# EAGLE design hw3 (EAGLE 7.5.0)
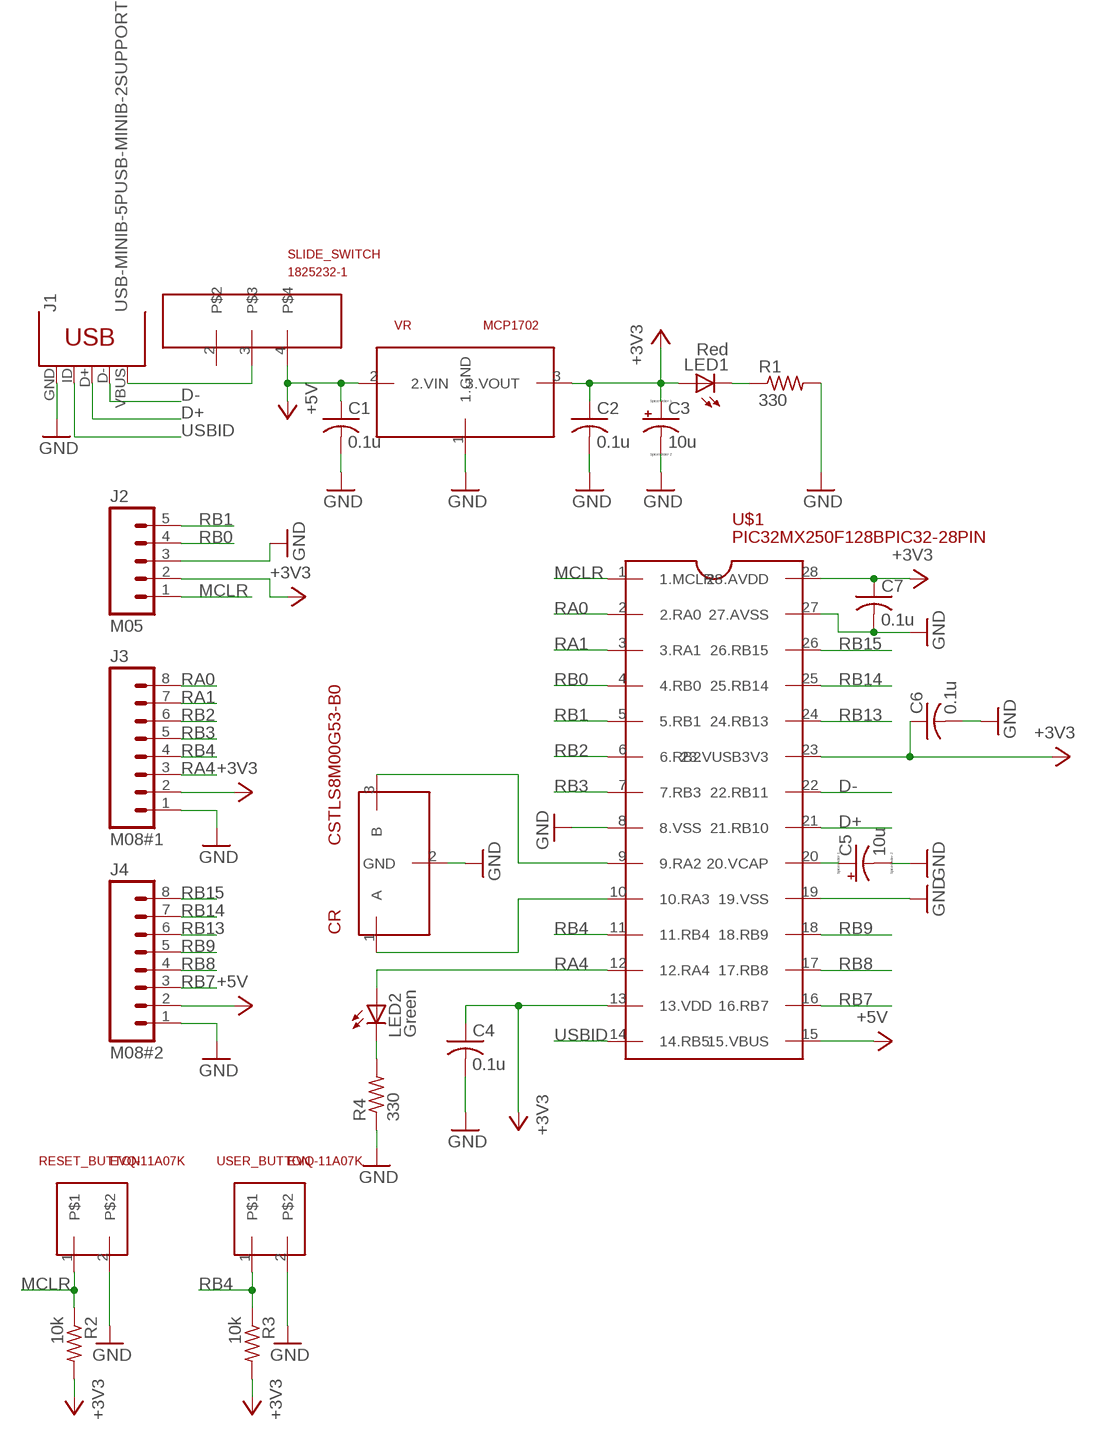
[diagram p0: schematic, sheet 1]

## Parts
C1  0.1u  C-US025-025X050  [C025-025X050]
C2  0.1u  C-US025-025X050  [C025-025X050]
C3  10u  CPOL-USB45181A  [B45181A]
C4  0.1u  C-US025-025X050  [C025-025X050]
C5  10u  CPOL-USB45181A  [B45181A]
C6  0.1u  C-US025-025X050  [C025-025X050]
C7  0.1u  C-US025-025X050  [C025-025X050]
CR  CSTLS8M00G53-B0  [1X03_NO_SILK]
J1  USB-MINIB-5PUSB-MINIB-2SUPPORT  [USB-MB-H]
J2  M05  M05NO_SILK  [1X05_NO_SILK]
J3  M08#1  M08  [1X08_ROUND]
J4  M08#2  M08  [1X08_ROUND]
LED1  Red  LED3MM  [LED3MM]
LED2  Green  LED3MM  [LED3MM]
R1  330  R-US_0207/10  [0207/10]
R2  10k  R-US_0207/10  [0207/10]
R3  10k  R-US_0207/10  [0207/10]
R4  330  R-US_0207/10  [0207/10]
RESET_BUTTON  EVQ-11A07K  [1X02_NO_SILK_FAR_BOUNDED]
SLIDE_SWITCH  1825232-1  [1X05_SLIDESWITCH]
U$1  PIC32MX250F128BPIC32-28PIN  [DIL28-3]
USER_BUTTON  EVQ-11A07K  [1X02_NO_SILK_FAR_BOUNDED]
VR  MCP1702  [TO92]

## Nets
+3V3: C2.1 C3.+ C4.1 C6.1 C7.1 J2.2 J3.2 LED1.A R2.2 R3.2 U$1.13(13.VDD) U$1.23(23.VUSB3V3) U$1.28(28.AVDD) VR.3(3.VOUT)
+5V: C1.1 J4.2 SLIDE_SWITCH.4 U$1.15(15.VBUS) VR.2(2.VIN)
D+: J1.D+ U$1.21(21.RB10)
D-: J1.D- U$1.22(22.RB11)
GND: C1.2 C2.2 C3.- C4.2 C5.- C6.2 C7.2 CR.2(GND) J1.GND J2.3 J3.1 J4.1 R1.2 R4.1 RESET_BUTTON.2 U$1.8(8.VSS) U$1.19(19.VSS) U$1.27(27.AVSS) USER_BUTTON.2 VR.1(1.GND)
MCLR: J2.1 R2.1 RESET_BUTTON.1 U$1.1(1.MCLR)
N$1: LED2.K(C) R4.2
N$2: C5.+ U$1.20(20.VCAP)
N$3: LED1.K(C) R1.1
N$4: J1.VBUS SLIDE_SWITCH.3
N$5: CR.3(B) U$1.9(9.RA2)
N$6: CR.1(A) U$1.10(10.RA3)
RA0: J3.8 U$1.2(2.RA0)
RA1: J3.7 U$1.3(3.RA1)
RA4: J3.3 LED2.A U$1.12(12.RA4)
RB0: J2.4 U$1.4(4.RB0)
RB1: J2.5 U$1.5(5.RB1)
RB2: J3.6 U$1.6(6.RB2)
RB3: J3.5 U$1.7(7.RB3)
RB4: J3.4 R3.1 U$1.11(11.RB4) USER_BUTTON.1
RB7: J4.3 U$1.16(16.RB7)
RB8: J4.4 U$1.17(17.RB8)
RB9: J4.5 U$1.18(18.RB9)
RB13: J4.6 U$1.24(24.RB13)
RB14: J4.7 U$1.25(25.RB14)
RB15: J4.8 U$1.26(26.RB15)
USBID: J1.ID U$1.14(14.RB5)
Unconnected: SLIDE_SWITCH.2

## Library data of the parts
C1 C2 C4 C6 C7 = hw2:C-US: CAPACITOR, American symbol
C3 C5 = hw2:CPOL-US: POLARIZED CAPACITOR, American symbol
CR = hw2:CSTLS8M00G53-B0: Crystal resonator. Middle pin is ground.
J1 = hw2:USB-MINIB-5P: Mini-USB "B" connector with 5th pin broken out. Created new symbol breaking out 5th "ID" pin in mini/micro USB connector spec. See: http://en.wikipedia.org/wiki/Mini_usb#Cables. Uses same footprint as 4-pin symbol. Also added pins to connect to mounting / shield pads if required (probably not generally needed as signals aren't shielded once they leave the connector).
J2 = hw2:M05: Header 5 Standard 5-pin 0.1" header. Use with straight break away headers (SKU : PRT-00116), right angle break away headers (PRT-00553), swiss pins (PRT-00743), machine pins (PRT-00117), and female headers (PRT-00115). Molex polarized connector foot print use with SKU : PRT-08230 with associated crimp pins and housings.
J3 J4 = hw2:M08: Header 8 Standard 8-pin 0.1" header. Use with straight break away headers (SKU : PRT-00116), right angle break away headers (PRT-00553), swiss pins (PRT-00743), machine pins (PRT-00117), and female headers (PRT-00115).; PROD_ID: CONN-08437
LED1 LED2 = hw2:LED: LED OSRAM: - CHIPLED LG R971, LG N971, LY N971, LG Q971, LY Q971, LO R971, LY R971 LH N974, LH R974 LS Q976, LO Q976, LY Q976 LO Q996 - Hyper CHIPLED LW Q18S LB Q993, LB Q99A, LB R99A - SideLED LS A670, LO A670, LY A670, LG A670, LP A670 LB A673, LV A673, LT A673, LW A673 LH A674 LY A675 LS A676, LA A676, LO A676, LY A676, LW A676 LS A679, LY A679, LG A679 - Hyper Micro SIDELED® LS Y876, LA Y876, LO Y876, LY Y876 LT Y87S - SmartLED LW L88C, LW L88S LB L89C, LB L89S, LG L890 LS L89K, LO L89K, LY L89K LS L896, LA L896, LO L896, LY L896 - TOPLED LS T670, LO T670, LY T670, LG T670, LP T670 LSG T670, LSP T670, LSY T670, LOP T670, LYG T670 LG T671, LOG T671, LSG T671 LB T673, LV T673, LT T673, LW T673 LH T674 LS T676, LA T676, LO T676, LY T676, LB T676, LH T676, LSB T676, LW T676 LB T67C, LV T67C, LT T67C, LS T67K, LO T67K, LY T67K, LW E67C LS E67B, LA E67B, LO E67B, LY E67B, LB E67C, LV E67C, LT E67C LW T67C LS T679, LY T679, LG T679 LS T770, LO T770, LY T770, LG T770, LP T770 LB T773, LV T773, LT T773, LW T773 LH T774 LS E675, LA E675, LY E675, LS T675 LS T776, LA T776, LO T776, LY T776, LB T776 LHGB T686 LT T68C, LB T68C - Hyper Mini TOPLED® LB M676 - Mini TOPLED Santana® LG M470 LS M47K, LO M47K, LY M47K Source: http://www.osram.convergy.de LUXEON: - LUMILED® LXK2-PW12-R00, LXK2-PW12-S00, LXK2-PW14-U00, LXK2-PW14-V00 LXK2-PM12-R00, LXK2-PM12-S00, LXK2-PM14-U00 LXK2-PE12-Q00, LXK2-PE12-R00, LXK2-PE12-S00, LXK2-PE14-T00, LXK2-PE14-U00 LXK2-PB12-K00, LXK2-PB12-L00, LXK2-PB12-M00, LXK2-PB14-N00, LXK2-PB14-P00, LXK2-PB14-Q00 LXK2-PR12-L00, LXK2-PR12-M00, LXK2-PR14-Q00, LXK2-PR14-R00 LXK2-PD12-Q00, LXK2-PD12-R00, LXK2-PD12-S00 LXK2-PH12-R00, LXK2-PH12-S00 LXK2-PL12-P00, LXK2-PL12-Q00, LXK2-PL12-R00 Source: www.luxeon.com KINGBRIGHT: KA-3528ASYC Source: www.kingbright.com
R1-R4 = hw2:R-US_: RESISTOR, American symbol
RESET_BUTTON USER_BUTTON = hw2:EVQ-11A07K: Pushbutton
SLIDE_SWITCH = hw2:1825232-1: Slide switch. Only PIN3 and PIN4 are used.
U$1 = hw2:PIC32MX250F128B
VR = hw2:MCP1702: Voltage regulator 1. GND 2. VIN 3. VOUT

## Board
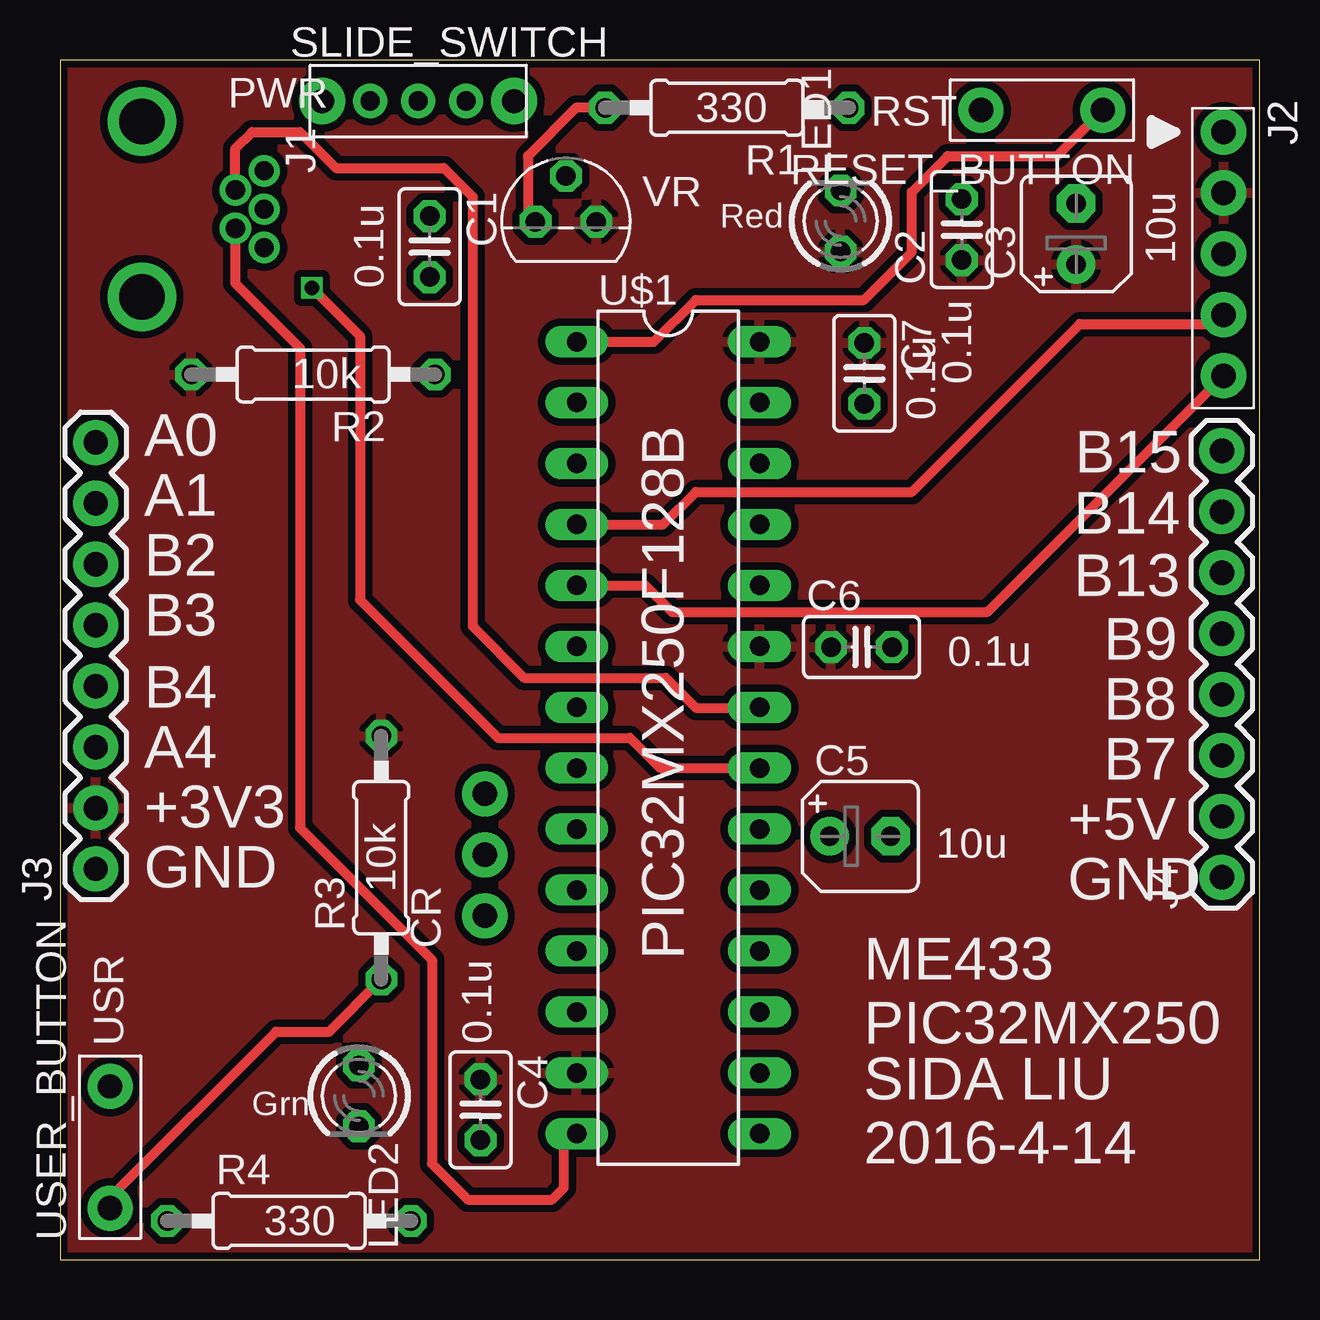
[diagram p1: board, top side]
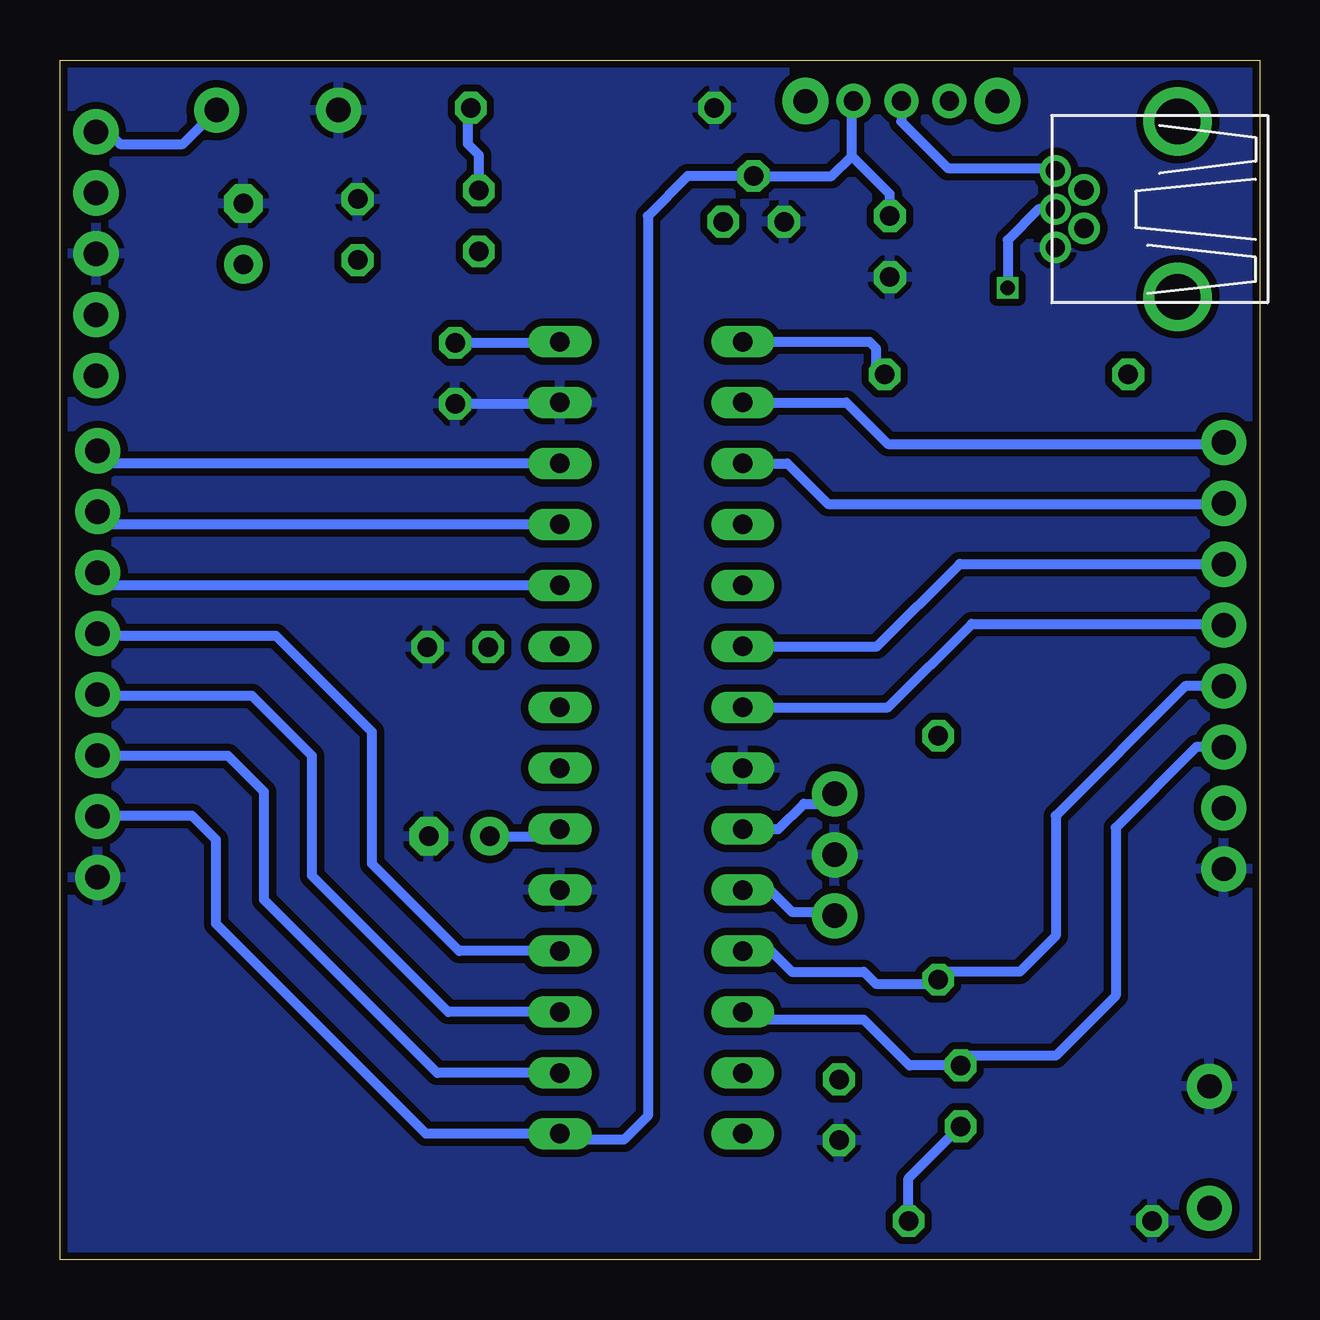
[diagram p2: board, bottom side, seen from below]

Size 50 x 50 mm. Coordinates in mm from the lower left corner, seen from the top.
Outline: 0,0 50,0 50,50 0,50 0,0
Copper layers (1*16): Top 0.035mm / dielectric 1.5mm / Bottom 0.035mm
Design rules "SeeedStudio_2layer_DRU_no_angle_20140221": minimum track width 6mil, minimum drill 12mil, track to track 6mil, track to pad 6mil, pad to pad 6mil, via to via 6mil, smd to smd 0mil, copper to edge 10mil, drill to drill 10mil, minimum pad ring 10mil, minimum via ring 6mil, stop-mask expansion 2mil, vias tented up to drill 100mil, thermal gap 10mil

### Footprints (pad centres in the part's own frame; a part is rotated, then mirrored left to right if it is on the bottom)
C025-025X050 = drill 0.813 octagon: 1 -1.27,0; 2 1.27,0
B45181A = drill 0.813 pad 1.6: + -1.27,0 | drill 0.813 pad 1.6 octagon: - 1.27,0
1X03_NO_SILK = drill 1.016 pad 1.88: 1 0,0; 2 2.54,0; 3 5.08,0
USB-MB-H = drill 0.8: D+ 5.1,0; D- 3.9,0.8; GND 5.1,-1.6; ID 3.9,-0.8; VBUS 5.1,1.6 | drill 1.9: P$6 0,-3.65; P$7 0,3.65
1X05_NO_SILK = drill 1.016 pad 1.88: 1 0,0; 2 2.54,0; 3 5.08,0; 4 7.62,0; 5 10.16,0
1X08_ROUND = drill 1.016 pad 1.88: 1 0,0; 2 2.54,0; 3 5.08,0; 4 7.62,0; 5 10.16,0; 6 12.7,0; 7 15.24,0; 8 17.78,0
LED3MM = drill 0.813 octagon: A -1.27,0; K 1.27,0
0207/10 = drill 0.813 octagon: 1 -5.08,0; 2 5.08,0
1X02_NO_SILK_FAR_BOUNDED = drill 1.016 pad 1.88: 1 0,0; 2 5.08,0
1X05_SLIDESWITCH = drill 1 pad 1.93: 1 0,0; 5 8,0 | drill 0.8 pad 1.422: 2 2,0; 3 4,0; 4 6,0
DIL28-3 = drill 0.813 long: 1 -16.51,-3.81; 2 -13.97,-3.81; 3 -11.43,-3.81; 4 -8.89,-3.81; 5 -6.35,-3.81; 6 -3.81,-3.81; 7 -1.27,-3.81; 8 1.27,-3.81; 9 3.81,-3.81; 10 6.35,-3.81; 11 8.89,-3.81; 12 11.43,-3.81; 13 13.97,-3.81; 14 16.51,-3.81; 15 16.51,3.81; 16 13.97,3.81; 17 11.43,3.81; 18 8.89,3.81; 19 6.35,3.81; 20 3.81,3.81; 21 1.27,3.81; 22 -1.27,3.81; 23 -3.81,3.81; 24 -6.35,3.81; 25 -8.89,3.81; 26 -11.43,3.81; 27 -13.97,3.81; 28 -16.51,3.81
TO92 = drill 0.813 octagon: 1 -1.27,0; 2 0,1.905; 3 1.27,0

### Placement (x,y rotation side)
C1  15.41,42.22 270 top
C2  37.59,42.93 90 top
C3  42.36,42.75 90 top
C4  17.53,6.24 270 top
C5  33.36,17.64 0 top
C6  33.41,25.53 0 top
C7  33.53,36.94 270 top
CR  17.71,14.33 90 top
J1  3.41,43.78 0 top
J2  48.5,47 270 top
J3  1.49,16.28 90 top
J4  48.43,15.93 90 top
LED1  32.54,43.29 90 top
LED2  12.46,6.82 270 top
R1  27.8,48.01 180 top
R2  10.55,36.89 180 top
R3  13.39,16.75 90 top
R4  9.55,1.61 0 top
RESET_BUTTON  43.47,47.91 180 top
SLIDE_SWITCH  10.93,48.29 0 top
U$1  25.35,21.75 270 top
USER_BUTTON  2.09,2.14 90 top
VR  21.09,43.26 0 top

### Tracks (layer width: path | path; a pad name or v marks a point on that pad's centre or on a via)
+3V3
  Bottom 0.406: C7.1 29.21,38.21 U$1.28
  pour Top (isolate 0.305): 0,50 50,50 50,0 0,0
+5V
  Bottom 0.406: C1.1 15.41,44.41 17,46 | 17,46 17,48.22 SLIDE_SWITCH.4 | 17,46 17.84,45.16 VR.2 23.84,45.16 25.5,43.5 25.5,6 26.5,5 28.92,5 U$1.15 34.74,5.24 43.5,14 43.5,17.5 44.5,18.5 48.4,18.5 J4.2
D+  (via drill 0.6)
  Top 0.406: v10.5,40.5 12.5,38.5 12.5,27.5 18.25,21.75 23.75,21.75 25,20.5 29.14,20.5 U$1.21
  Bottom 0.406: J1.D+ 9.22,43.78 10.5,42.5 v10.5,40.5
D-
  Top 0.406: J1.D- 7.31,46.31 8,47 10,47 11.5,45.5 16,45.5 17.2,44.3 17.2,26.4 19.35,24.25 25.25,24.25 26.5,23 29.14,23 U$1.22
GND
  Top 0.406: R1.2 21.51,48.01 19.5,46 19.5,43.58 VR.1
  Bottom 0.406: C7.2 29.21,35.67 U$1.27
  pour Bottom (isolate 0.305): 0,50 50,50 50,0 0,0
MCLR
  Top 0.406: U$1.1 24.76,38.26 26.5,40 33.5,40 35.5,42 35.5,44.5 37,46 41.56,46 RESET_BUTTON.1
  Bottom 0.406: U$1.1 16.26,38.26 16,38 16,37.26 R2.1 | J2.1 48,47 47.5,46.5 44.88,46.5 RESET_BUTTON.1
N$1
  Bottom 0.406: R4.2 14.63,3.38 LED2.K
N$2
  Bottom 0.406: C5.+ 29.46,17.64 U$1.20
N$3
  Bottom 0.406: LED1.K 32.54,46.04 33,46.5 33,47.89 R1.1
N$4
  Bottom 0.406: SLIDE_SWITCH.3 14.93,47.43 13,45.5 8.63,45.5 J1.VBUS
N$5
  Bottom 0.406: U$1.9 20.06,17.94 19,19 18.12,19 CR.3
N$6
  Bottom 0.406: U$1.10 20.4,15.4 19.5,14.5 17.88,14.5 CR.1
RA0
  Bottom 0.406: J3.8 1.55,34 15.5,34 17.22,35.72 U$1.2
RA1
  Bottom 0.406: J3.7 1.51,31.5 18,31.5 19.68,33.18 U$1.3
RA4
  Bottom 0.406: U$1.12 21.22,10 16.5,10 14.59,8.09 LED2.A 12.05,8.5 8.5,8.5 6,11 6,18 2.64,21.36 J3.3
RB0
  Top 0.406: U$1.4 25.14,30.64 26.5,32 35.5,32 42.5,39 48.12,39 J2.4
RB1
  Top 0.406: U$1.5 24.4,28.1 25.5,27 38.66,27 J2.5
RB2
  Bottom 0.406: U$1.6 15.94,25.56 12.5,29 1.51,29 J3.6
RB3
  Bottom 0.406: U$1.7 15.48,23.02 12,26.5 1.55,26.5 J3.5
RB4
  Top 0.406: USER_BUTTON.1 2.09,2.59 9,9.5 11.22,9.5 R3.1
  Bottom 0.406: J3.4 3.1,23.9 8.5,18.5 8.5,13.5 10,12 13.06,12 R3.1 13.56,11.5 16,11.5 16.5,12 19.5,12 20.36,12.86 U$1.11
RB7
  Bottom 0.406: U$1.16 34.28,7.78 41.5,15 41.5,19.5 43,21 J4.3
RB8
  Bottom 0.406: U$1.17 33.82,10.32 39.5,16 39.5,21 42,23.5 48.38,23.5 J4.4
RB9
  Bottom 0.406: U$1.18 33.36,12.86 37,16.5 37,22 41,26 48.34,26 J4.5
RB13
  Bottom 0.406: U$1.24 47.9,28.1 J4.6
RB14
  Bottom 0.406: U$1.25 47.9,30.64 J4.7
RB15
  Bottom 0.406: U$1.26 47.9,33.18 J4.8
USBID
  Top 0.406: J1.ID 7.31,40.69 10,38 10,18 15.5,12.5 15.5,4 17,2.5 20.5,2.5 21,3 21,4.7 U$1.14

### Text on the board
tPlace: PWR | 330 | RST | Red | 10u | 0.1u | 10k | 0.1u | 0.1u | A0 | B15 | A1 | B14 | B2 | B13 | B3 | 0.1u | B9 | B4 | B8 | A4 | B7 | +3V3 | 10u | +5V | GND | 10k | GND | PIC32MX250F128B | USR | 0.1u | ME433 / PIC32MX250 | Grn | SIDA LIU / 2016-4-14 | 330